# Altium schematic sheet Sheet_1_2022-03-14.schdoc
size 309 x 204 mm
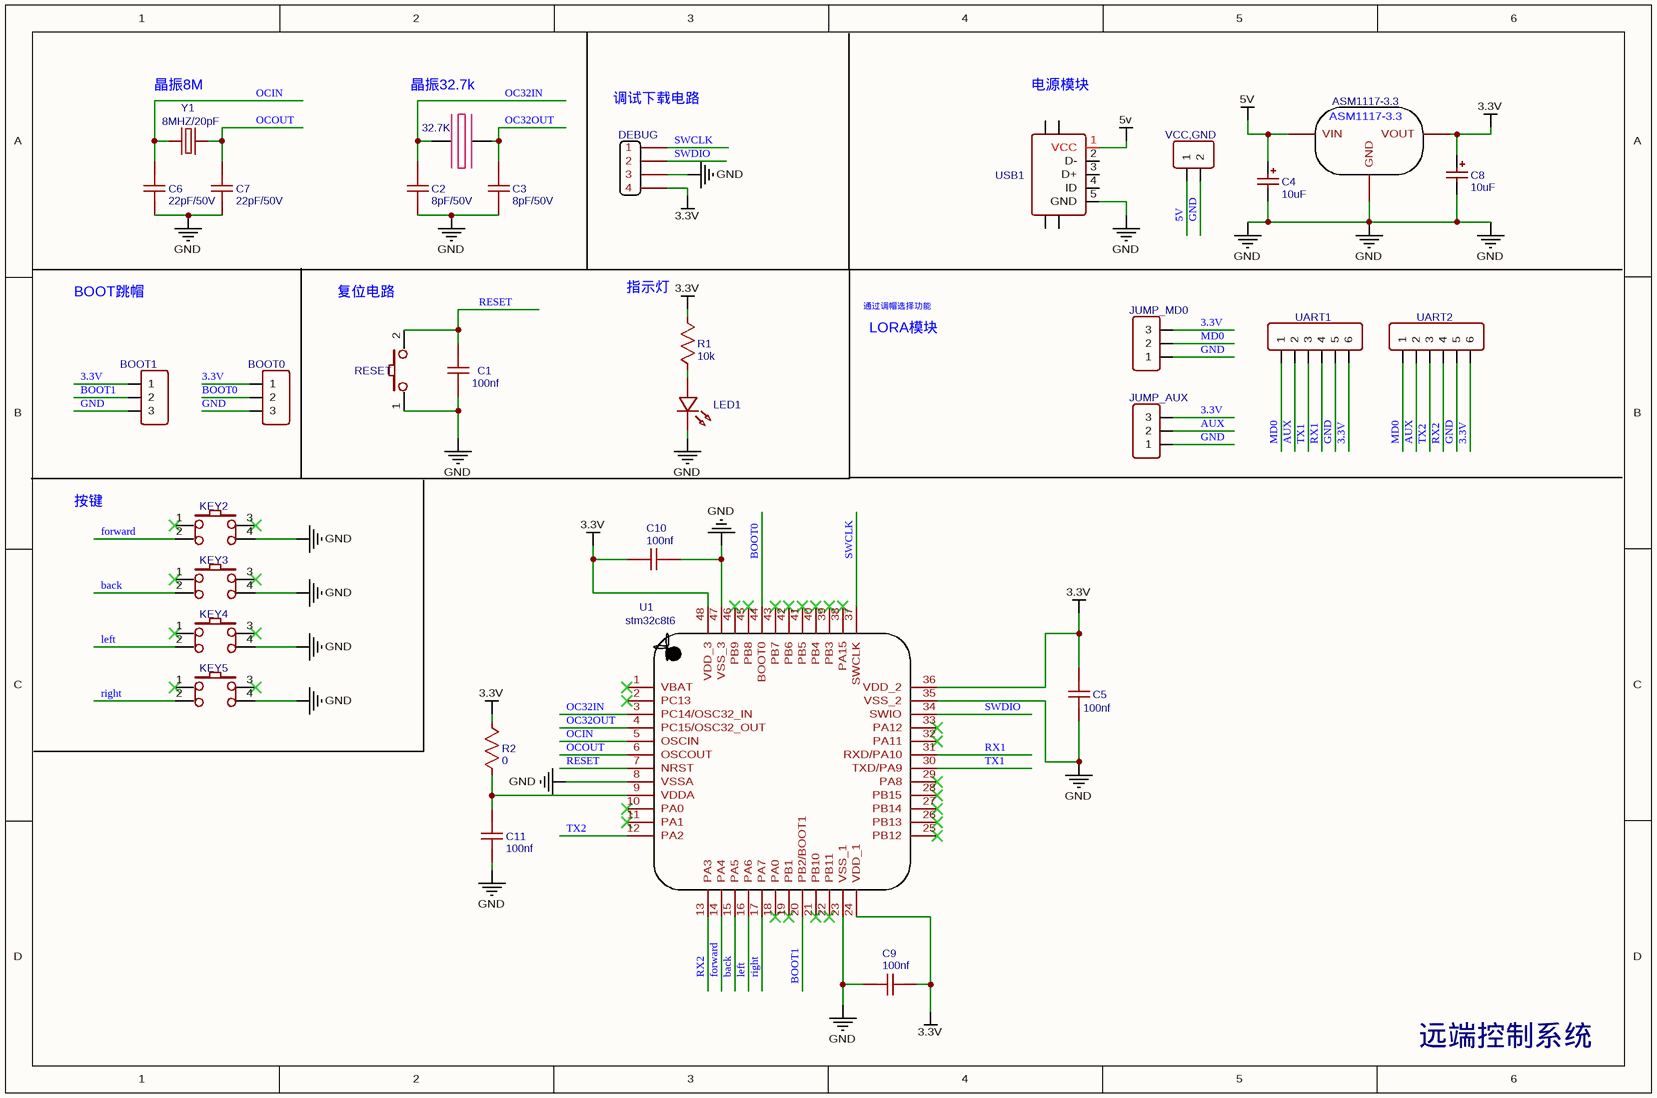
[diagram p0: Sheet_1_2022-03-14.schdoc]

## Parts
5V-3.3V  ASM1117-3.3  [ASM1117-5.0-SOT223]
BOOT0  HDR-M-2.54_1x3  [HDR-M-2.54_1X3]  (value not drawn)
BOOT1  HDR-M-2.54_1x3  [HDR-M-2.54_1X3]  (value not drawn)
C1  100nf  [C0603]
C2  8pF/50V  [0603_C_JX]
C3  8pF/50V  [0603_C_JX]
C4  10uF  [CASE-R_2012]
C5  100nf  [C0603]
C6  22pF/50V  [0603_C_JX]
C7  22pF/50V  [0603_C_JX]
C8  10uF  [CASE-R_2012]
C9  100nf  [C0603]
C10  100nf  [C0603]
C11  100nf  [C0603]
DEBUG  M_2.54_1*4P_JX  [M_2.54_1*4P_JX]  (value not drawn)
JUMP_AUX  HDR-M-2.54_1x3  [HDR-M-2.54_1X3]  (value not drawn)
JUMP_MD0  HDR-M-2.54_1x3  [HDR-M-2.54_1X3]  (value not drawn)
KEY2  B3SL-1022P贴片开关  [KEY-6.5*6.2]  (value not drawn)
KEY3  B3SL-1022P贴片开关  [KEY-6.5*6.2]  (value not drawn)
KEY4  B3SL-1022P贴片开关  [KEY-6.5*6.2]  (value not drawn)
KEY5  B3SL-1022P贴片开关  [KEY-6.5*6.2]  (value not drawn)
LED1  LED-0603_R  [LED0603_RED]  (value not drawn)
R1  10k  [R0603]
R2  0  [R0603]
RESET  Switch  [KEY-3.0*4.0]  (value not drawn)
U1  stm32c8t6  [48LQFP]
UART1  HDR-F-2.54_1x6  [HDR-F-2.54_1X6]  (value not drawn)
UART2  HDR-F-2.54_1x6  [HDR-F-2.54_1X6]  (value not drawn)
USB1  USB-MINI-SMD-9.2X9.4-H3.7  [MINI-USB-SMD_C105424]  (value not drawn)
VCC,GND  HDR-M-2.54_1x2  [HDR-M-2.54_1X2]  (value not drawn)
X1  32.7K  [32.768]
Y1  8MHZ/20pF  [HC-49SMD_JX]

## Nets
3.3V: 5V-3.3V.2(VOUT) BOOT0.1 BOOT1.1 C5.2 C8.1 C9.1 C10.2 DEBUG.4 JUMP_AUX.3 JUMP_MD0.3 R1.2 R2.2 U1.24(VDD_1) U1.36(VDD_2) U1.48(VDD_3) UART1.6 UART2.6
5V: 5V-3.3V.3(VIN) C4.1 USB1.1(VCC) VCC,GND.1
GND: 5V-3.3V.1(GND) BOOT0.3 BOOT1.3 C1.1 C2.2 C3.2 C4.2 C5.1 C6.2 C7.2 C8.2 C9.2 C10.1 C11.2 DEBUG.3 JUMP_AUX.1 JUMP_MD0.1 KEY2.4 KEY3.4 KEY4.4 KEY5.4 LED1.2 RESET.1 U1.8(VSSA) U1.23(VSS_1) U1.35(VSS_2) U1.47(VSS_3) UART1.5 UART2.5 USB1.5(GND) VCC,GND.2
AUX: JUMP_AUX.2 UART1.2 UART2.2
back: KEY3.2 U1.15(PA5)
BOOT0: BOOT0.2 U1.44(BOOT0)
BOOT1: BOOT1.2 U1.20(PB2/BOOT1)
forward: KEY2.2 U1.14(PA4)
left: KEY4.2 U1.16(PA6)
MD0: JUMP_MD0.2 UART1.1 UART2.1
OC32IN: C2.1 U1.3(PC14/OSC32_IN) X1.1
OC32OUT: C3.1 U1.4(PC15/OSC32_OUT) X1.2
OCIN: C6.1 U1.5(OSCIN) Y1.1
OCOUT: C7.1 U1.6(OSCOUT) Y1.2
RESET: C1.2 RESET.2 U1.7(NRST)
right: KEY5.2 U1.17(PA7)
RX1: U1.31(RXD/PA10) UART1.4
RX2: U1.13(PA3) UART2.4
SWCLK: DEBUG.1 U1.37(SWCLK)
SWDIO: DEBUG.2 U1.34(SWIO)
TX1: U1.30(TXD/PA9) UART1.3
TX2: U1.12(PA2) UART2.3
NetC11_1: C11.1 R2.1 U1.9(VDDA)
NetLED1_1: LED1.1 R1.1

Not connected (* = marked no-connect by the designer): KEY2 1* 3*; KEY3 1* 3*; KEY4 1* 3*; KEY5 1* 3*; U1 1(VBAT)* 2(PC13)* 10(PA0)* 11(PA1)* 18(PA0)* 19(PB1)* 21(PB10)* 22(PB11)* 25(PB12)* 26(PB13)* 27(PB14)* 28(PB15)* 29(PA8)* 32(PA11)* 33(PA12)* 38(PA15)* 39(PB3)* 40(PB4)* 41(PB5)* 42(PB6)* 43(PB7)* 45(PB8)* 46(PB9)*; USB1 2(D-) 3(D+) 4(ID) 6 7 8 9

## Notes on the sheet
- (near Y1) 晶振8M
- (near X1) 晶振32.7k
- (near DEBUG) 调试下载电路
- (near USB1) 电源模块
- BOOT跳帽
- 复位电路
- (near R1) 指示灯
- 通过调帽选择功能
- LORA模块
- 按键
- 远端控制系统

## Library data of the parts
5V-3.3V = ASM1117-3.3: Contributor: 15770626102wlh; spicePre: U; spiceSymbolName: ASM1117-3.3
BOOT0 BOOT1 JUMP_AUX JUMP_MD0 = HDR-M-2.54_1x3: Contributor: LCEDA_Lib; BOM_Supplier Part: C180248; BOM_Supplier: LCSC; spicePre: J; spiceSymbolName: HDR-M-2.54_1x3
C1 C5 C9-C11 = 100nf: nameAlias: Value(F); Contributor: LCEDA_Lib; spicePre: C; spiceSymbolName: C_0603_US
C2 C3 = 8pF/50V: nameAlias: Value(F); spicePre: C; spiceSymbolName: Capacitor; BOM_Supplier: LCSC
C4 C8 = 10uF: BOM_Manufacturer: AVX; BOM_Manufacturer Part: TAJR106M006RNJ; Voltage: 3V; Tolerance: ±20%; BOM_EasyEDA: E7235; Value: 10uF; BOM_Supplier Part: E7235; BOM_Supplier: EasyEDA; spicePre: C; spiceSymbolName: 10uF
C6 C7 = 22pF/50V: nameAlias: Value(F); spicePre: C; spiceSymbolName: Capacitor; BOM_Supplier: LCSC
KEY2-KEY5 = B3SL-1022P贴片开关: BOM_Manufacturer: OMRON; Contributor: yanghai; BOM_Supplier: LCSC; BOM_Manufacturer Part: B3SL-1022P; BOM_Supplier Part: C86708; spicePre: K; spiceSymbolName: B3SL-1022P贴片开关
LED1 = LED-0603_R: BOM_Manufacturer: EVERLIGHT(台湾亿光); BOM_Manufacturer Part: 19-217/R6C-AL1M2VY/3T; Contributor: LCEDA_01; BOM_Supplier Part: C72044; BOM_Supplier: LCSC; spicePre: L; spiceSymbolName: LED-0603_R
R1 = 10k: nameAlias: Value(Ω); Contributor: LCEDA_Lib; spicePre: R; spiceSymbolName: R_0603_US
R2 = 0: nameAlias: Value(Ω); Contributor: LCEDA_Lib; spicePre: R; spiceSymbolName: R_0603_US
RESET = Switch: BOM_Manufacturer: ReliaPro; BOM_Manufacturer Part: Switch3x4x2; BOM_Supplier: LCSC; BOM_Supplier Part: C26638; spicePre: K; spiceSymbolName: Switch3x4x2
U1 = stm32c8t6: Contributor: yichenJ; BOM_Manufacturer Part: stm32c8t6; BOM_Supplier: LCSC; spicePre: U; spiceSymbolName: stm32c8t6
UART1 UART2 = HDR-F-2.54_1x6: Contributor: LCEDA_Lib; BOM_Supplier Part: C40877; BOM_Supplier: LCSC; spicePre: H; spiceSymbolName: HDR-F-2.54_1x6
USB1 = USB-MINI-SMD-9.2X9.4-H3.7: BOM_Manufacturer: LCSC; BOM_Supplier: LCSC; BOM_Supplier Part: C105424; BOM_Manufacturer Part: USB-MINI-SMD-9.2X9.4-H3.7; Contributor: LCSC; spicePre: U; spiceSymbolName: USB-MINI-SMD-9.2X9.4-H3.7
VCC,GND = HDR-M-2.54_1x2: Contributor: LCEDA_Lib; BOM_Supplier Part: C124375; BOM_Supplier: LCSC; spicePre: J; spiceSymbolName: HDR-M-2.54_1x2
X1 = 32.7K: Contributor: Chinaghost; spicePre: X; spiceSymbolName: 32.768圆柱晶振
Y1 = 8MHZ/20pF: catid: 20; spicePre: Y; BOM_Supplier: LCSC
DEBUG = M_2.54_1*4P_JX: BOM_Supplier: LCSC; spicePre: P